# Altium schematic sheet Proyecto1.SchDoc
size Letter; Author: Adrián Fernández; Organization: Altium Limited; Address1: L3, 12a Rodborough Rd; Address2: Frenchs Forest; Address3: NSW; Address4: Australia 2086; Revision: 1.0; Carnet: 23381; Curso: Digital 2
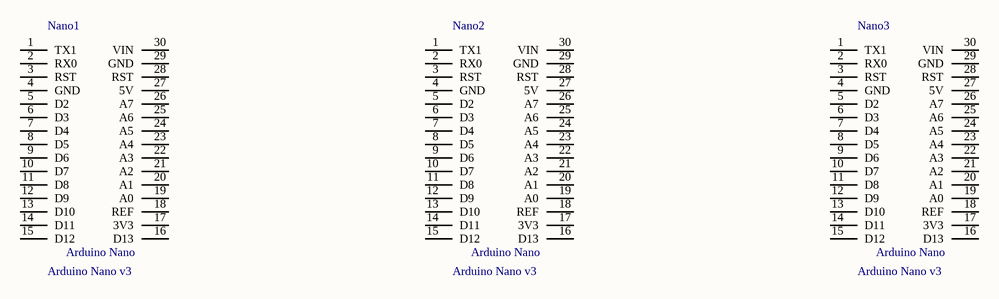
[diagram p0: Proyecto1.SchDoc]

## Parts
Nano1  Arduino Nano v3  [Arduin Nano.PcbLib]
Nano2  Arduino Nano v3  [Arduin Nano.PcbLib]
Nano3  Arduino Nano v3  [Arduin Nano.PcbLib]

## Nets

Not connected (* = marked no-connect by the designer): Nano1 1(TX1) 2(RX0) 3(RST) 4(GND) 5(D2) 6(D3) 7(D4) 8(D5) 9(D6) 10(D7) 11(D8) 12(D9) 13(D10) 14(D11) 15(D12) 16(D13) 17(3V3) 18(REF) 19(A0) 20(A1) 21(A2) 22(A3) 23(A4) 24(A5) 25(A6) 26(A7) 27(5V) 28(RST) 29(GND) 30(VIN); Nano2 1(TX1) 2(RX0) 3(RST) 4(GND) 5(D2) 6(D3) 7(D4) 8(D5) 9(D6) 10(D7) 11(D8) 12(D9) 13(D10) 14(D11) 15(D12) 16(D13) 17(3V3) 18(REF) 19(A0) 20(A1) 21(A2) 22(A3) 23(A4) 24(A5) 25(A6) 26(A7) 27(5V) 28(RST) 29(GND) 30(VIN); Nano3 1(TX1) 2(RX0) 3(RST) 4(GND) 5(D2) 6(D3) 7(D4) 8(D5) 9(D6) 10(D7) 11(D8) 12(D9) 13(D10) 14(D11) 15(D12) 16(D13) 17(3V3) 18(REF) 19(A0) 20(A1) 21(A2) 22(A3) 23(A4) 24(A5) 25(A6) 26(A7) 27(5V) 28(RST) 29(GND) 30(VIN)

## Notes on the sheet
- Proyecto:
- Autor:
- Carnet:
- Documento:
- Curso:
- Fecha:
- Revisión:
- Tamaño:
- Carta
- Hoja:
- de
- (in symbol Arduin Nano.SchLib) Arduino Nano

## Library data of the parts
Nano1-Nano3 = Arduin Nano.SchLib: ATmega328 Microcontroller Development Board 16MHz CPU 2KB RAM 1KB/32KB EEPROM/Flash; Manufacturer Part Number: A000005; Core Architecture: AVR; Data Bus Width: 8b; Evaluation Kit: Yes; Interface: I2C, SPI, USB; Max Supply Voltage: 12V; Memory Size: 32kB; Memory Format: FLASH; Min Supply Voltage: 7V; Nominal Supply Current: 19mA; Number of Bits: 8; Number of I/Os: 22; Operating Supply Voltage: 20V; Supplier: DigiKey; Supplier Part Number: 1050-1001-ND; Manufacturer: Arduino; RoHS: Compliant; Category: DSPs - Digital Signal Processors; Stock: 589; Pricing: 1=25.7, 10=25.19, 25=24.75, 50=24.09, 100=23.0001, 250=21.97012 (USD); Frequency: 16MHz; Height: 6.35mm; Length: 177.8mm; REACH SVHC: No; Schedule B: 8542900000, 8542900000|8542900000|8542900000|8542900000|8542900000; Weight: 9.071847g; Width: 127mm; ComponentLink1URL: https://datasheet.octopart.com:443/A000005-Arduino-datasheet-13287805.pdf?src-supplier=element14+APAC; ComponentLink1Description: https://datasheet.octopart.com:443/A000005-Arduino-datasheet-13287805.pdf?src-supplier=element14+APAC; ComponentLink2URL: https://datasheet.octopart.com:443/A000005-Arduino-datasheet-10406030.pdf?src-supplier=Farnell; ComponentLink2Description: https://datasheet.octopart.com:443/A000005-Arduino-datasheet-10406030.pdf?src-supplier=Farnell; ComponentLink3URL: https://datasheet.octopart.com:443/A000005-Arduino-datasheet-10406460.pdf?src-supplier=Newark; ComponentLink3Description: https://datasheet.octopart.com:443/A000005-Arduino-datasheet-10406460.pdf?src-supplier=Newark; ComponentLink4URL: https://datasheet.octopart.com:443/A000005-Arduino-datasheet-140208021.pdf?src-supplier=RS+(Formerly+Allied+Electronics); ComponentLink4Description: https://datasheet.octopart.com:443/A000005-Arduino-datasheet-140208021.pdf?src-supplier=RS+(Formerly+Allied+Electronics); ComponentLink5URL: https://datasheet.octopart.com:443/A000005-Arduino-datasheet-165884306.pdf?src-supplier=RS+(Formerly+Allied+Electronics); ComponentLink5Description: https://datasheet.octopart.com:443/A000005-Arduino-datasheet-165884306.pdf?src-supplier=RS+(Formerly+Allied+Electronics); ComponentLink6URL: https://datasheet.octopart.com:443/A000005-Arduino-datasheet-151952201.pdf?src-supplier=SOS+electronic; ComponentLink6Description: https://datasheet.octopart.com:443/A000005-Arduino-datasheet-151952201.pdf?src-supplier=SOS+electronic; ComponentLink7URL: https://datasheet.octopart.com:443/A000005-Arduino-datasheet-154319405.pdf?src-supplier=Jameco; ComponentLink7Description: https://datasheet.octopart.com:443/A000005-Arduino-datasheet-154319405.pdf?src-supplier=Jameco; ComponentLink8URL: https://datasheet.octopart.com:443/A000005-Arduino-datasheet-17721990.pdf?src-supplier=Factory+Futures; ComponentLink8Description: https://datasheet.octopart.com:443/A000005-Arduino-datasheet-17721990.pdf?src-supplier=Factory+Futures